# Altium schematic sheet USB-UART (FTDI FT230XS).SchDoc
size A4; Revision: 0; SheetNumber: 1
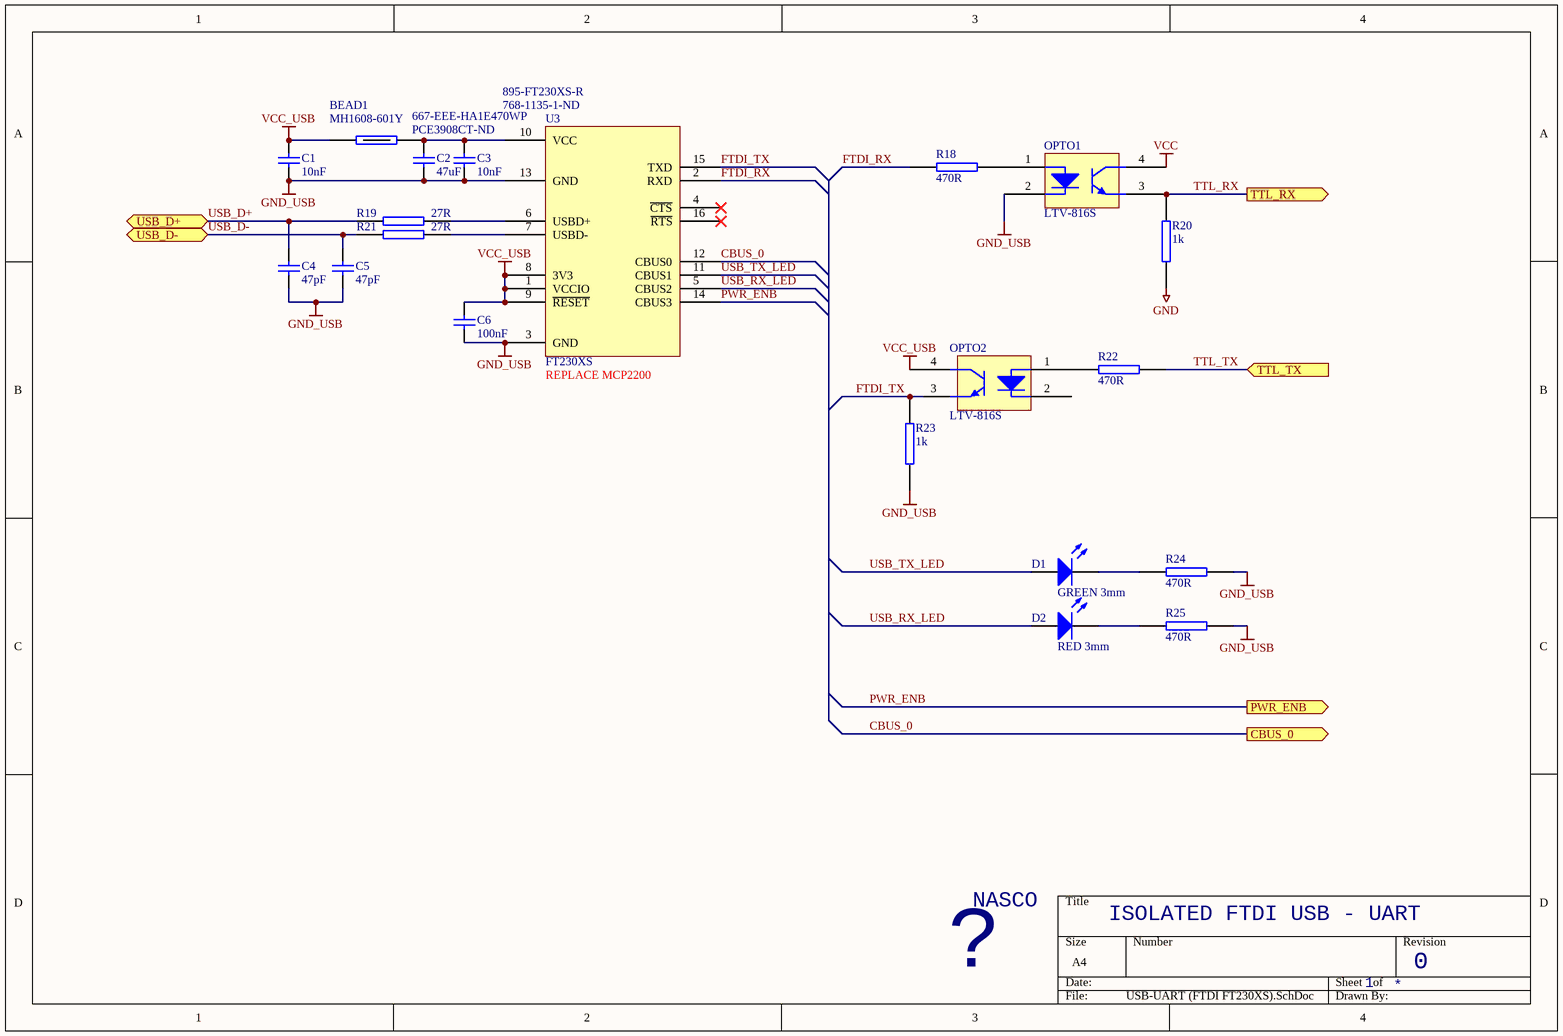
[diagram p0: USB-UART (FTDI FT230XS).SchDoc]

## Parts
BEAD1  MH1608-601Y  [RES (3D) - 0603]
C1  10nF  [CAP (3D) - 0603]
C2  Supplier Part Number 1: PCE3908CT-ND  Supplier Part Number 2: 667-EEE-HA1E470WP  [CAP ELECTRO SIZE-D]  (hidden comment: 47uF)
C3  10nF  [CAP (3D) - 0603]
C4  47pF  [CAP (3D) - 0603]
C5  47pF  [CAP (3D) - 0603]
C6  100nF  [CAP (3D) - 0603]
D1  GREEN 3mm  [LED(3D) 3MM VERTICAL (GREEN)]
D2  RED 3mm  [LED(3D) 3MM VERTICAL (GREEN)]
OPTO1  LTV-816S  [S-DIP-B8]
OPTO2  LTV-816S  [S-DIP-B8]
R18  470R  [RES (3D) - 0603]
R19  27R  [RES (3D) - 0603]
R20  1k  [RES (3D) - 0603]
R21  27R  [RES (3D) - 0603]
R22  470R  [RES (3D) - 0603]
R23  1k  [RES (3D) - 0603]
R24  470R  [RES (3D) - 0603]
R25  470R  [RES (3D) - 0603]
U3  FT230XS  Supplier Part Number 1: 768-1135-1-ND  Supplier Part Number 2: 895-FT230XS-R  [SSOP16_L]

## Ports
CBUS_0 (out), PWR_ENB (out), TTL_RX (out), TTL_TX (in), USB_D+ (bidir), USB_D- (bidir)

## Nets
GND: R20.1
GND_USB: C1.1 C2.1 C3.1 C4.1 C5.1 C6.1 OPTO1.2 R23.1 R24.2 R25.2 U3.3(GND) U3.13(GND)
VCC: OPTO1.4
VCC_USB: BEAD1.1 C1.2 C6.2 OPTO2.4 U3.1(VCCIO) U3.8(3V3) U3.9(~{RESET})
CBUS_0: U3.12(CBUS0) ; port CBUS_0
FTDI_RX: R18.1 U3.2(RXD)
FTDI_TX: OPTO2.3 R23.2 U3.15(TXD)
PWR_ENB: U3.14(CBUS3) ; port PWR_ENB
TTL_RX: OPTO1.3 R20.2 ; port TTL_RX
TTL_TX: R22.2 ; port TTL_TX
USB_D+: C4.2 R19.1 ; port USB_D+
USB_D-: C5.2 R21.1 ; port USB_D-
USB_RX_LED: D2.1(A) U3.5(CBUS2)
USB_TX_LED: D1.1(A) U3.11(CBUS1)
NetBEAD1_2: BEAD1.2 C2.2 C3.2 U3.10(VCC)
NetD1_2: D1.2(K) R24.1
NetD2_2: D2.2(K) R25.1
NetOPTO1_1: OPTO1.1 R18.2
NetOPTO2_1: OPTO2.1 R22.1
NetR19_2: R19.2 U3.6(USBD+)
NetR21_2: R21.2 U3.7(USBD-)

Not connected (* = marked no-connect by the designer): OPTO2 2; U3 4(~{CTS})* 16(~{RTS})*

## Notes on the sheet
- (near U3) REPLACE MCP2200
- NASCO
- ISOLATED FTDI USB - UART
- ?

## Library data of the parts
BEAD1 = FERRITE BEAD 0603: FERRITE BEAD 0603 BOURNS MH1608-601Y; Value: MH1608-601Y
C1-C6 = Cap: Capacitor
  C1 C3: Value: 10nF
  C2: Value: 47uF; Supplier 1: Digi-Key; Supplier 2: Mouser
  C4 C5: Value: 47pF
  C6: Value: 100nF; Supplier 1: Mouser; Supplier 2: Digi-Key; Supplier Part Number 1: 603-C0603ZRY5V9BB104; Supplier Part Number 2: 311-1343-2-ND
D1 D2 = LED 3mm RED: 3mm RED LED; Manufacturer: Kingbright; Manufacturer Part No.: WP132XIT; Mouser Part no.: 604-WP132XIT; Farnell Part no.: 1003393; Web link: http://au.mouser.com/Search/Refine.aspx?Keyword=604-WP132XIT
  D1: Value: GREEN 3mm
  D2: Value: RED 3mm
OPTO1 OPTO2 = LTV-816S: Transistor Output Optocoupler; Supplier 1: Mouser; Supplier 2: Digi-Key; Supplier Part Number 1: 859-LTV-816S; Supplier Part Number 2: 160-1361-5-ND
R18 R20 R22-R25 = RES SMD 0603 1k: RESISTOR SMD 0603 1k
  R18 R22 R24 R25: value: 470R
  R20 R23: value: 1k
R19 R21 = RES SMD 0603 100R: RESISTOR SMD 0603; Value: 27R
U3 = FTDI FT230XS: FTDI FT230XS USB - UART; Supplier 1: Digi-Key; Supplier 2: Mouser